# EAGLE design WiFiPicoDMX_RevA (EAGLE 9.6.2)
WiFiPicoDMX Rev. A preliminary Fusion/EAGLE schematic. Generated from docs/hardware/SCHEMATIC_DESIGN.md. Electrical review and manufacturer footprint verification are mandatory before PCB release.

## Sheet 1 of 3
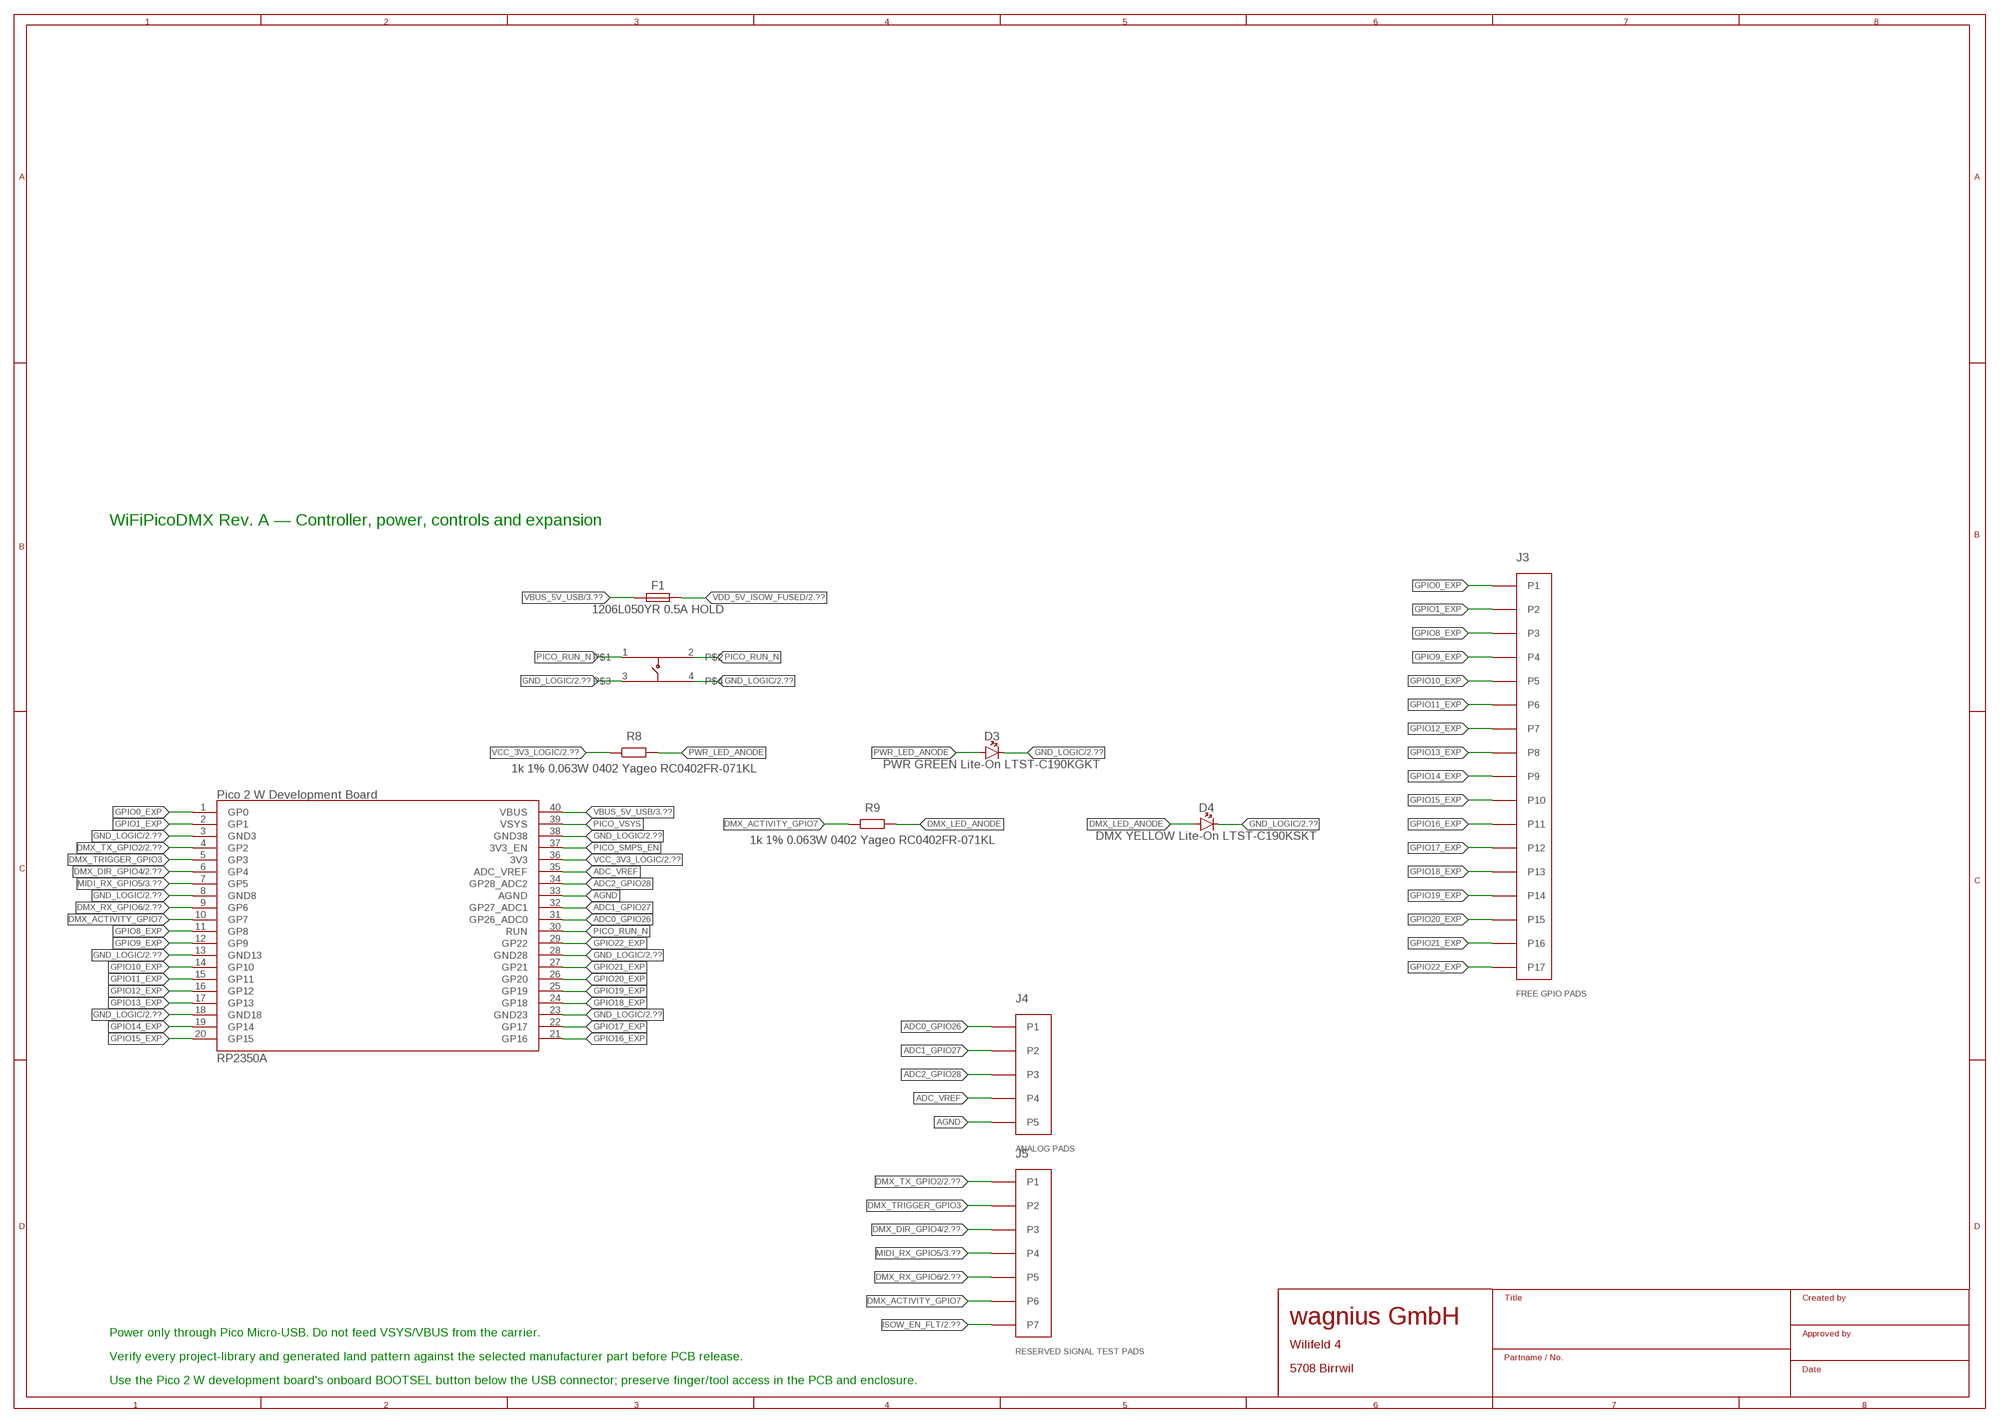
[diagram p0: schematic, sheet 1]

### Parts
D3  PWR GREEN Lite-On LTST-C190KGKT  LED0603  [LEDC1608X55N_FLAT-B]
D4  DMX YELLOW Lite-On LTST-C190KSKT  LED0603  [LEDC1608X55N_FLAT-B]
F1  1206L050YR 0.5A HOLD  PPTC1206  [PPTC1206_1206L050YR]
J3  FREE GPIO PADS  PADBANK17  [PADBANK17]
J4  ANALOG PADS  PADBANK5  [PADBANK5]
J5  RESERVED SIGNAL TEST PADS  PADBANK7  [PADBANK7]
R8  1k 1% 0.063W 0402 Yageo RC0402FR-071KL  RES0402  [RESC1005X40]
R9  1k 1% 0.063W 0402 Yageo RC0402FR-071KL  RES0402  [RESC1005X40]
SW1  PTS810SJM250SMTR LFS RESET (NO)  SWITCH_SMD  [PTS810_J_LEAD]
U1  Raspberry Pi Pico 2 W  PICO2W  [PICO_2_W_DEVELOPMENT_BOARD]

### Nets
ADC0_GPIO26: J4.1 U1.31(GP26_ADC0)
ADC1_GPIO27: J4.2 U1.32(GP27_ADC1)
ADC2_GPIO28: J4.3 U1.34(GP28_ADC2)
ADC_VREF: J4.4 U1.35(ADC_VREF)
AGND: J4.5 U1.33(AGND)
DMX_ACTIVITY_GPIO7: J5.6 R9.1 U1.10(GP7)
DMX_DIR_GPIO4: J5.3 U1.6(GP4) ; also sheet 2
DMX_LED_ANODE: D4.A R9.2
DMX_RX_GPIO6: J5.5 U1.9(GP6) ; also sheet 2
DMX_TRIGGER_GPIO3: J5.2 U1.5(GP3)
DMX_TX_GPIO2: J5.1 U1.4(GP2) ; also sheet 2
GND_LOGIC: D3.C(K) D4.C(K) SW1.3 SW1.4 U1.3(GND3) U1.8(GND8) U1.13(GND13) U1.18(GND18) U1.23(GND23) U1.28(GND28) U1.38(GND38) ; also sheet 2,3
GPIO0_EXP: J3.1 U1.1(GP0)
GPIO1_EXP: J3.2 U1.2(GP1)
GPIO8_EXP: J3.3 U1.11(GP8)
GPIO9_EXP: J3.4 U1.12(GP9)
GPIO10_EXP: J3.5 U1.14(GP10)
GPIO11_EXP: J3.6 U1.15(GP11)
GPIO12_EXP: J3.7 U1.16(GP12)
GPIO13_EXP: J3.8 U1.17(GP13)
GPIO14_EXP: J3.9 U1.19(GP14)
GPIO15_EXP: J3.10 U1.20(GP15)
GPIO16_EXP: J3.11 U1.21(GP16)
GPIO17_EXP: J3.12 U1.22(GP17)
GPIO18_EXP: J3.13 U1.24(GP18)
GPIO19_EXP: J3.14 U1.25(GP19)
GPIO20_EXP: J3.15 U1.26(GP20)
GPIO21_EXP: J3.16 U1.27(GP21)
GPIO22_EXP: J3.17 U1.29(GP22)
ISOW_EN_FLT: J5.7 ; also sheet 2
MIDI_RX_GPIO5: J5.4 U1.7(GP5) ; also sheet 3
PICO_RUN_N: SW1.1 SW1.2 U1.30(RUN)
PICO_SMPS_EN: U1.37(3V3_EN)
PICO_VSYS: U1.39(VSYS)
PWR_LED_ANODE: D3.A R8.2
VBUS_5V_USB: F1.1 U1.40(VBUS) ; also sheet 3
VCC_3V3_LOGIC: R8.1 U1.36(3V3) ; also sheet 2,3
VDD_5V_ISOW_FUSED: F1.2 ; also sheet 2

### Notes on the sheet
- WiFiPicoDMX Rev. A — Controller, power, controls and expansion
- Power only through Pico Micro-USB. Do not feed VSYS/VBUS from the carrier.
- Verify every project-library and generated land pattern against the selected manufacturer part before PCB release.
- Use the Pico 2 W development board's onboard BOOTSEL button below the USB connector; preserve finger/tool access in the PCB and enclosure.

## Sheet 2 of 3
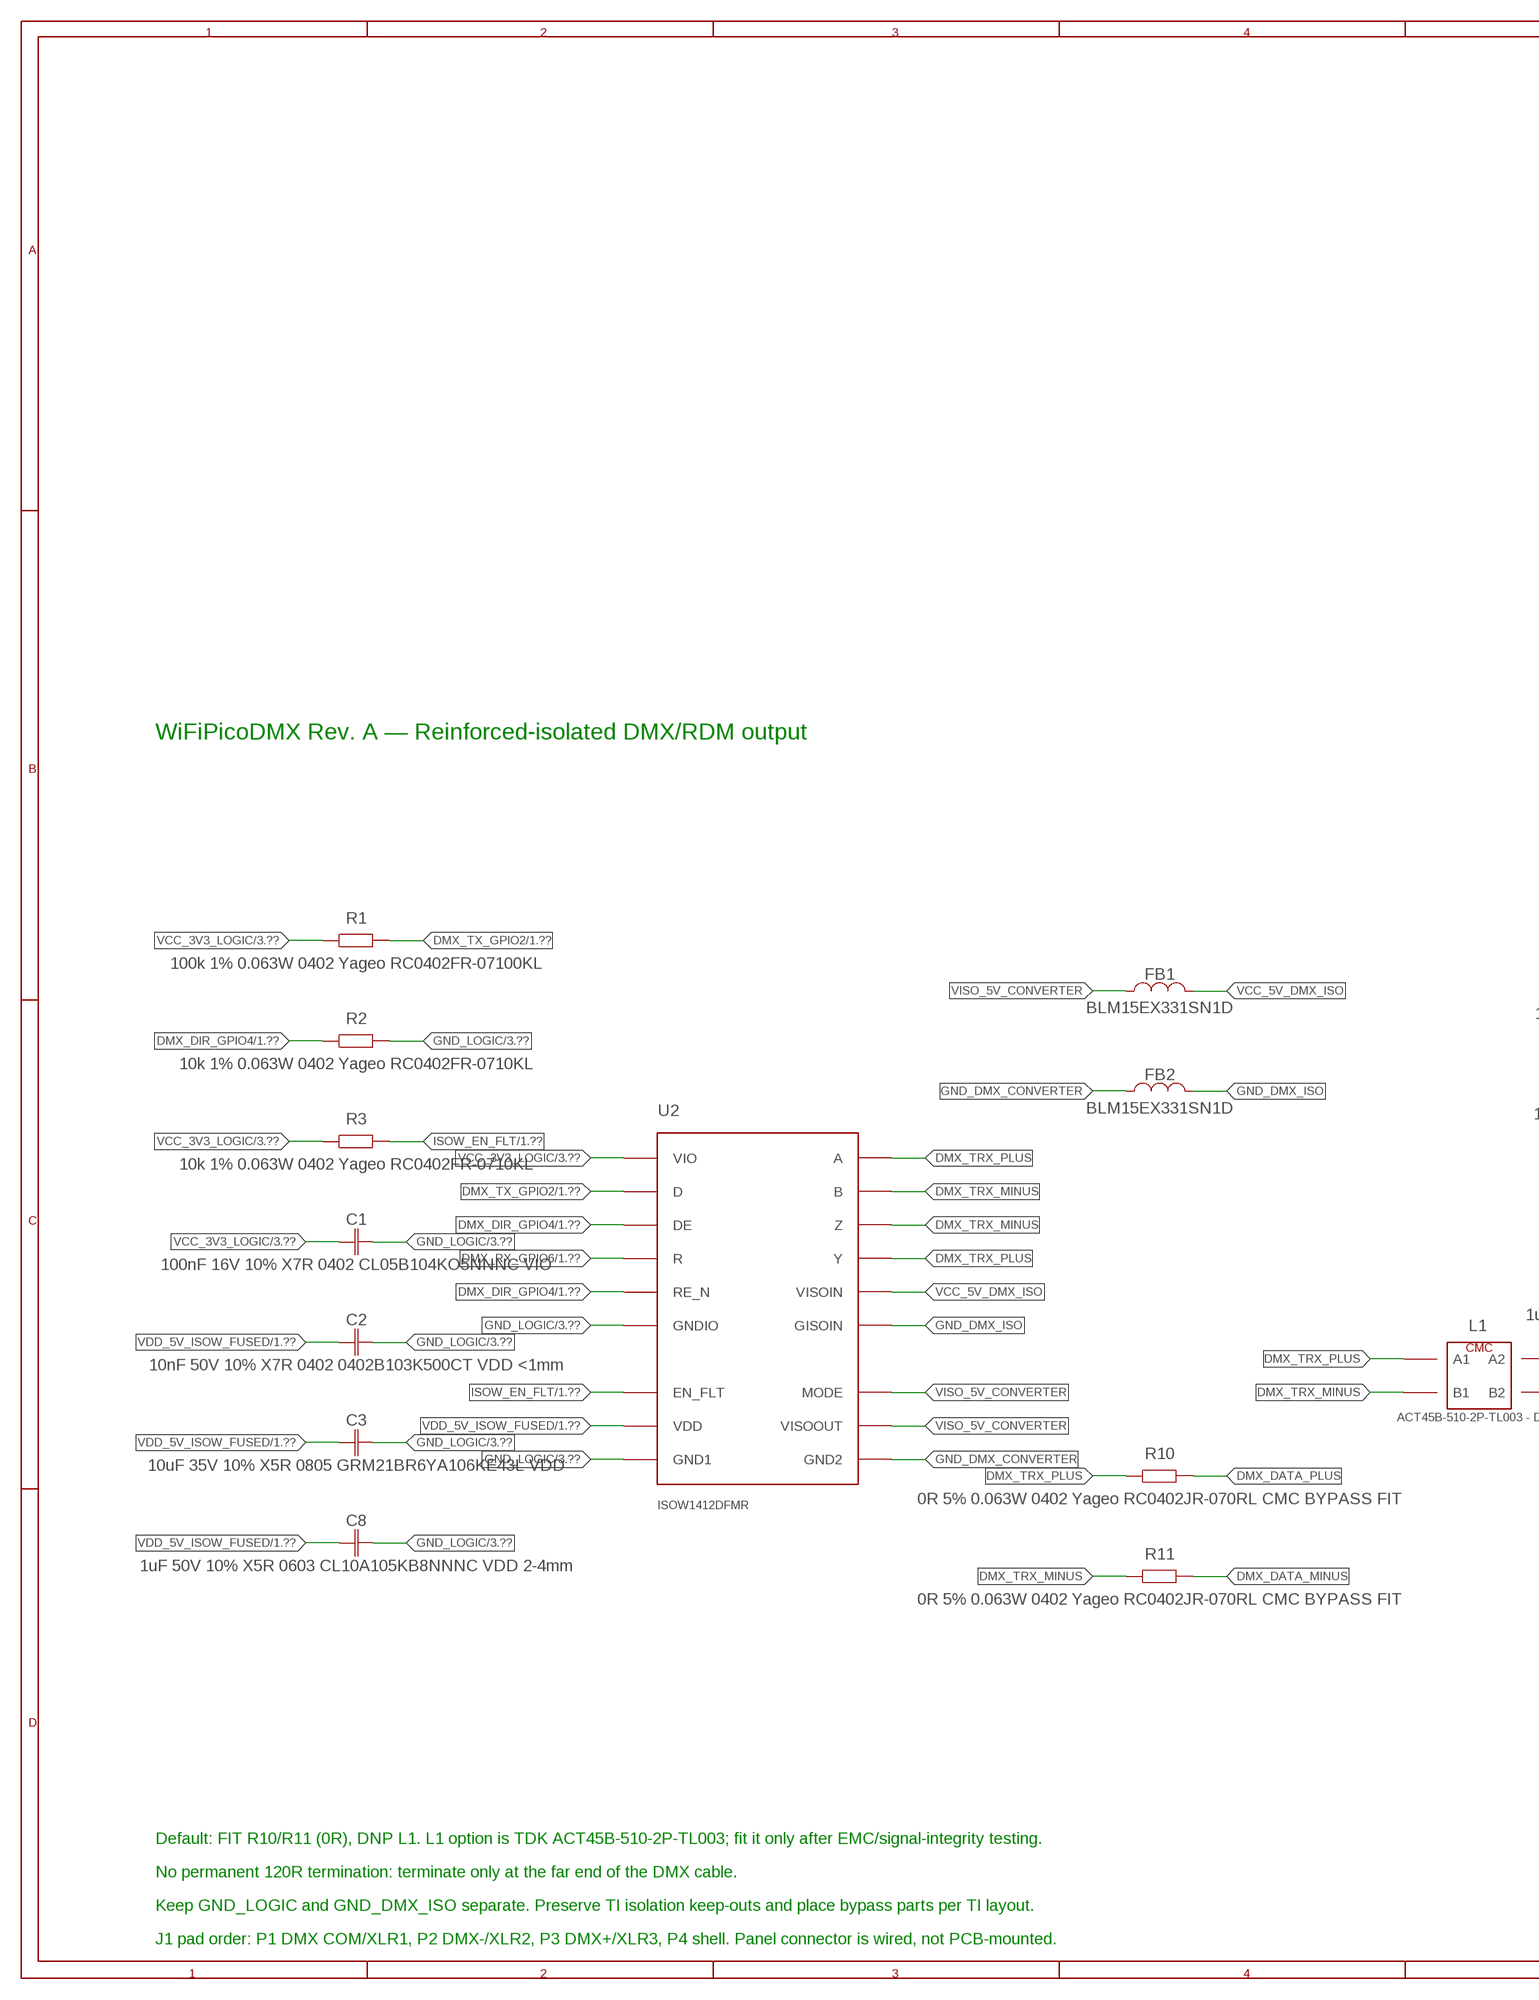
[diagram p1: schematic, sheet 2, part 1 of 2]
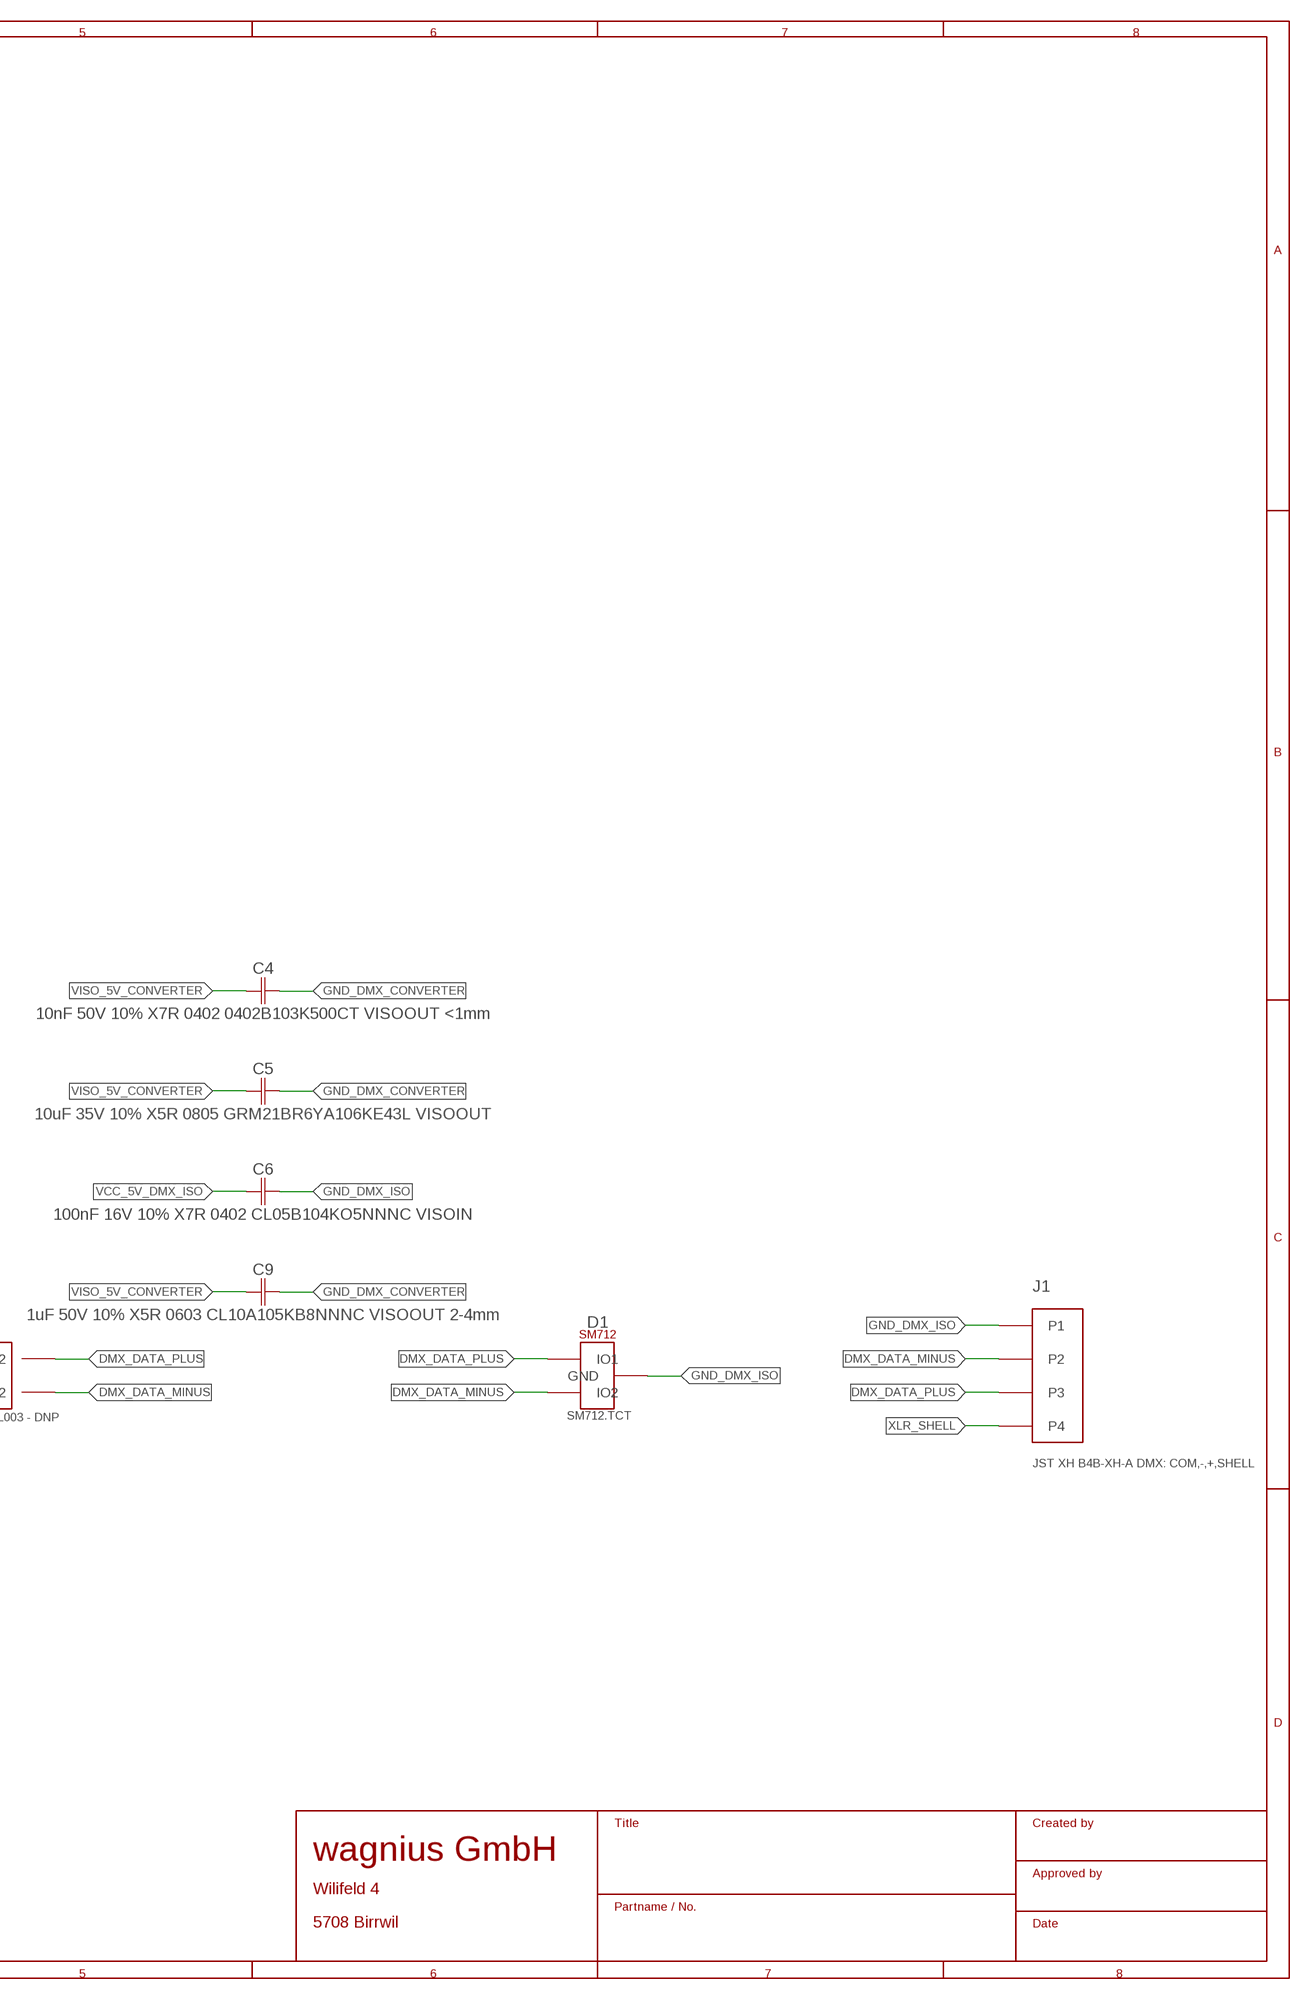
[diagram p2: schematic, sheet 2, part 2 of 2]

### Parts
C1  100nF 16V 10% X7R 0402 CL05B104KO5NNNC VIO  CAP0402  [CAPC1005X60]
C2  10nF 50V 10% X7R 0402 0402B103K500CT VDD <1mm  CAP0402  [CAPC1005X60]
C3  10uF 35V 10% X5R 0805 GRM21BR6YA106KE43L VDD  CAP0805  [CAPC2012X110]
C4  10nF 50V 10% X7R 0402 0402B103K500CT VISOOUT <1mm  CAP0402  [CAPC1005X60]
C5  10uF 35V 10% X5R 0805 GRM21BR6YA106KE43L VISOOUT  CAP0805  [CAPC2012X110]
C6  100nF 16V 10% X7R 0402 CL05B104KO5NNNC VISOIN  CAP0402  [CAPC1005X60]
C8  1uF 50V 10% X5R 0603 CL10A105KB8NNNC VDD 2-4mm  CAP0603  [CAPC1608X85]
C9  1uF 50V 10% X5R 0603 CL10A105KB8NNNC VISOOUT 2-4mm  CAP0603  [CAPC1608X85]
D1  SM712.TCT  SM712  [SOT23_]
FB1  BLM15EX331SN1D  FERRITE0402  [INDC1006X60N]
FB2  BLM15EX331SN1D  FERRITE0402  [INDC1006X60N]
J1  JST XH B4B-XH-A DMX: COM,-,+,SHELL  PANEL_DMX4  [B4B-XH-A]
L1  ACT45B-510-2P-TL003 - DNP  CMC_OPTION  [ACT45B_4P5X3P2]
R1  100k 1% 0.063W 0402 Yageo RC0402FR-07100KL  RES0402  [RESC1005X40]
R2  10k 1% 0.063W 0402 Yageo RC0402FR-0710KL  RES0402  [RESC1005X40]
R3  10k 1% 0.063W 0402 Yageo RC0402FR-0710KL  RES0402  [RESC1005X40]
R10  0R 5% 0.063W 0402 Yageo RC0402JR-070RL CMC BYPASS FIT  RES0402  [RESC1005X40]
R11  0R 5% 0.063W 0402 Yageo RC0402JR-070RL CMC BYPASS FIT  RES0402  [RESC1005X40]
U2  ISOW1412DFMR  [DFM0020A_TI]

### Nets
DMX_DATA_MINUS: D1.2(IO2) J1.2 L1.3(B2) R11.2
DMX_DATA_PLUS: D1.1(IO1) J1.3 L1.2(A2) R10.2
DMX_DIR_GPIO4: R2.1 U2.3(DE) U2.5(RE_N) ; also sheet 1
DMX_RX_GPIO6: U2.4(R) ; also sheet 1
DMX_TRX_MINUS: L1.4(B1) R11.1 U2.18(Z) U2.19(B)
DMX_TRX_PLUS: L1.1(A1) R10.1 U2.17(Y) U2.20(A)
DMX_TX_GPIO2: R1.2 U2.2(D) ; also sheet 1
GND_DMX_CONVERTER: C4.2 C5.2 C9.2 FB2.1 U2.11(GND2)
GND_DMX_ISO: C6.2 D1.3(GND) FB2.2 J1.1 U2.15(GISOIN)
GND_LOGIC: C1.2 C2.2 C3.2 C8.2 R2.2 U2.6(GNDIO) U2.10(GND1) ; also sheet 1,3
ISOW_EN_FLT: R3.2 U2.8(EN_FLT) ; also sheet 1
VCC_3V3_LOGIC: C1.1 R1.1 R3.1 U2.1(VIO) ; also sheet 1,3
VCC_5V_DMX_ISO: C6.1 FB1.2 U2.16(VISOIN)
VDD_5V_ISOW_FUSED: C2.1 C3.1 C8.1 U2.9(VDD) ; also sheet 1
VISO_5V_CONVERTER: C4.1 C5.1 C9.1 FB1.1 U2.12(VISOOUT) U2.13(MODE)
XLR_SHELL: J1.4

### Notes on the sheet
- WiFiPicoDMX Rev. A — Reinforced-isolated DMX/RDM output
- Default: FIT R10/R11 (0R), DNP L1. L1 option is TDK ACT45B-510-2P-TL003; fit it only after EMC/signal-integrity testing.
- No permanent 120R termination: terminate only at the far end of the DMX cable.
- Keep GND_LOGIC and GND_DMX_ISO separate. Preserve TI isolation keep-outs and place bypass parts per TI layout.
- J1 pad order: P1 DMX COM/XLR1, P2 DMX-/XLR2, P3 DMX+/XLR3, P4 shell. Panel connector is wired, not PCB-mounted.

## Sheet 3 of 3
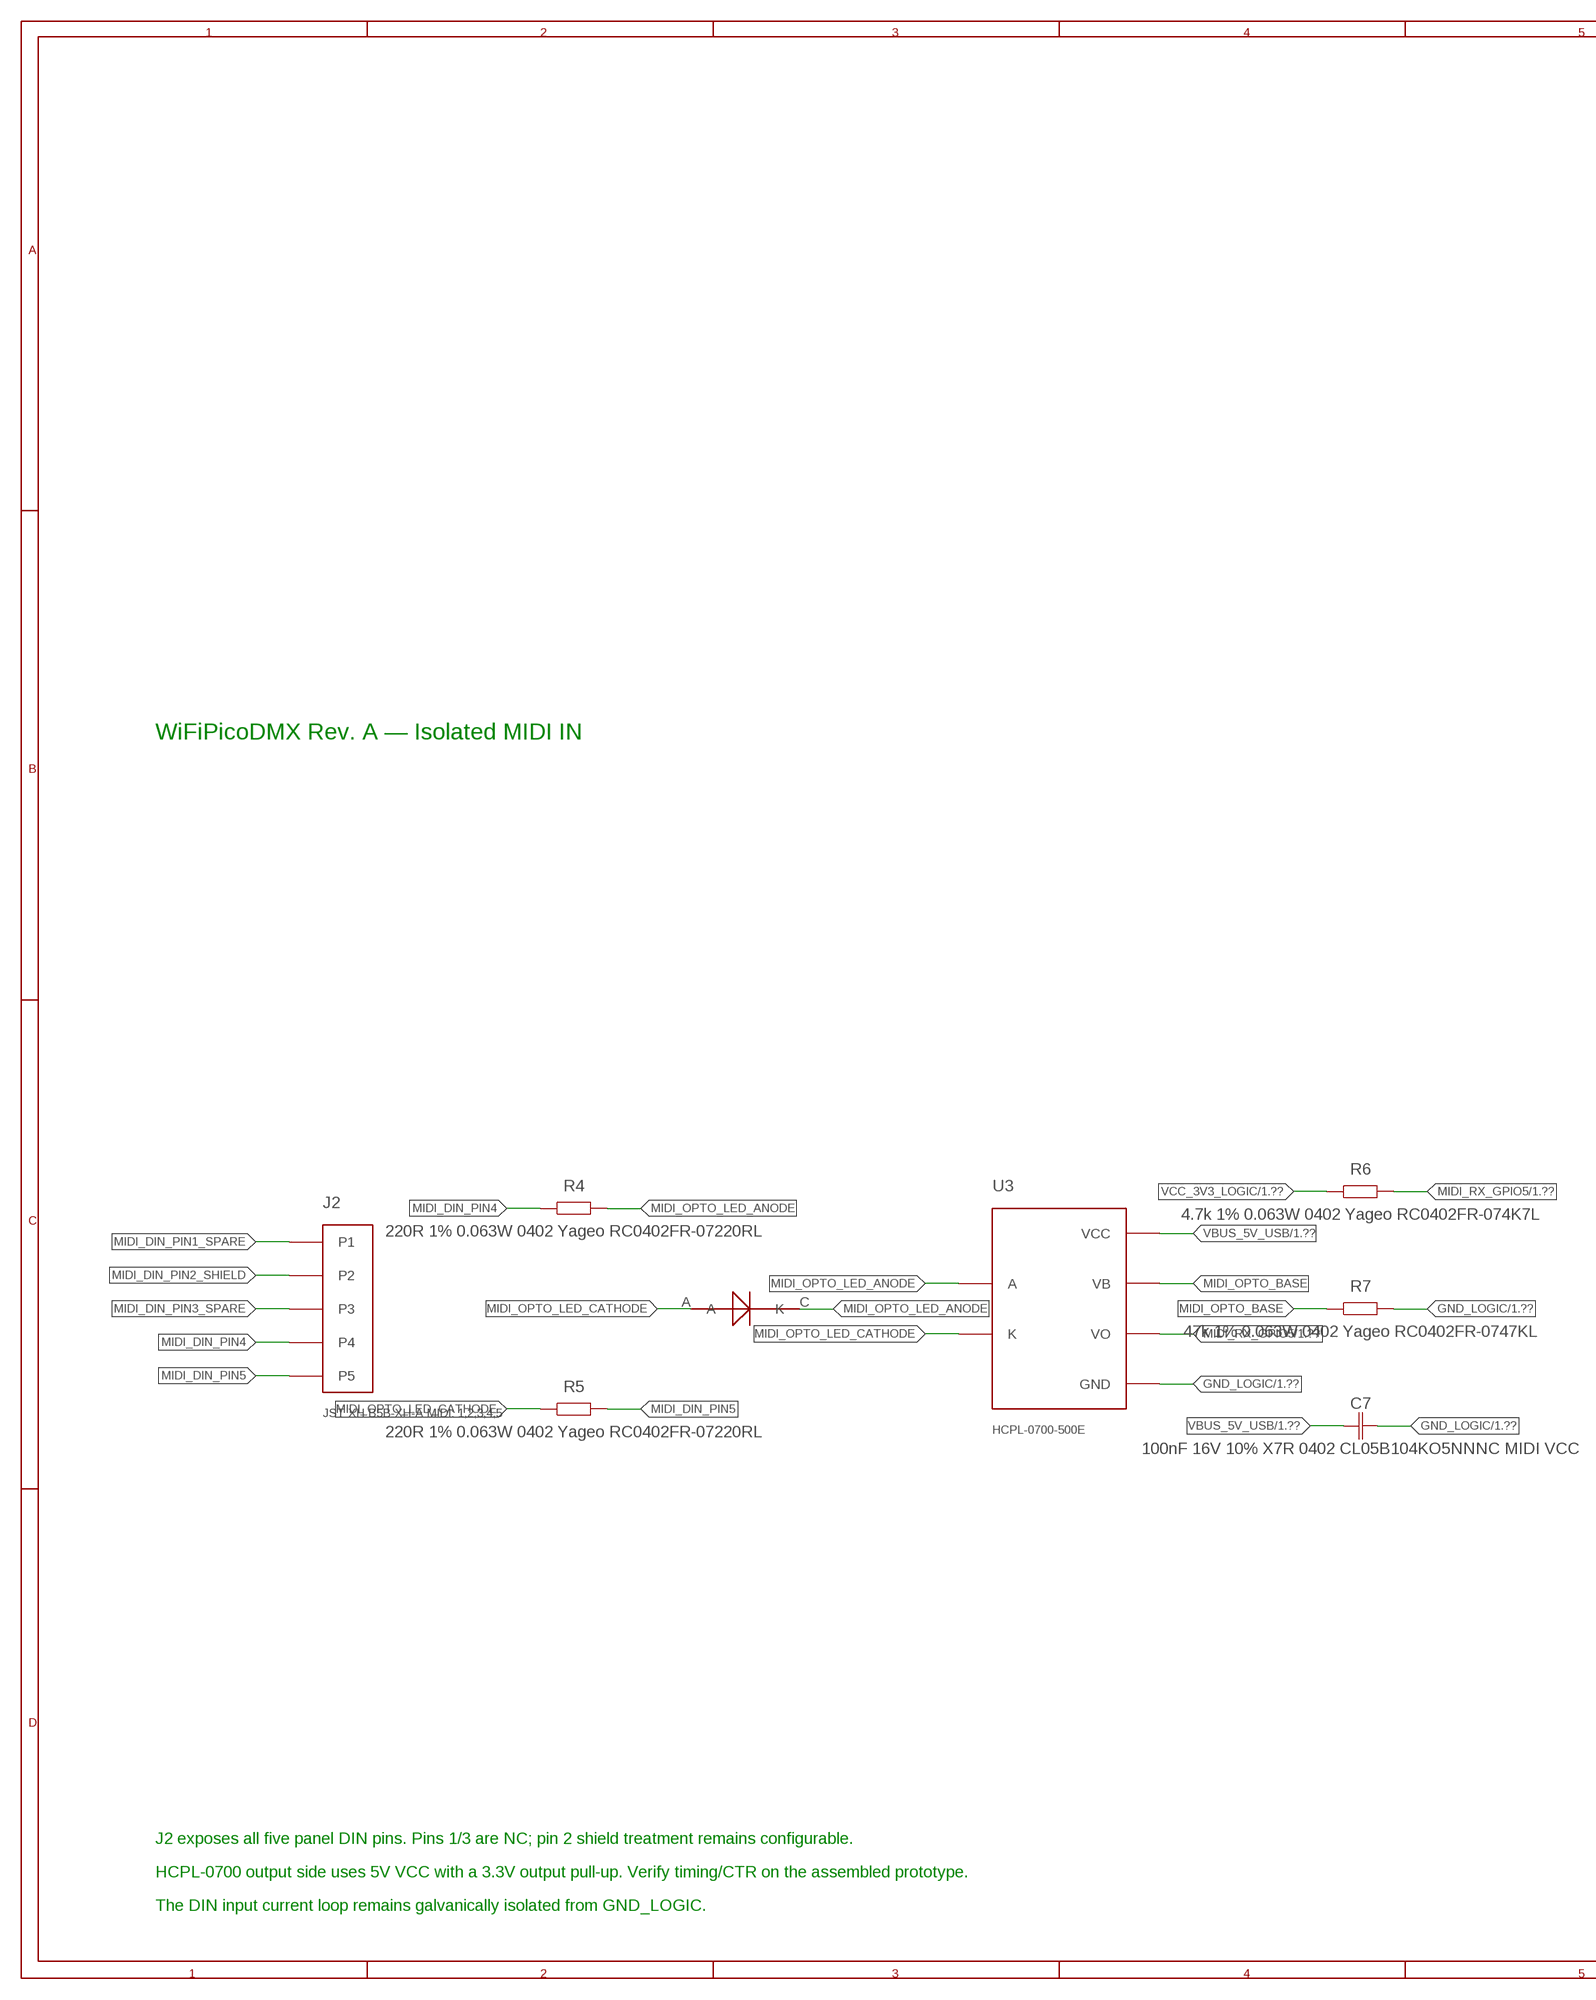
[diagram p3: schematic, sheet 3, part 1 of 2]
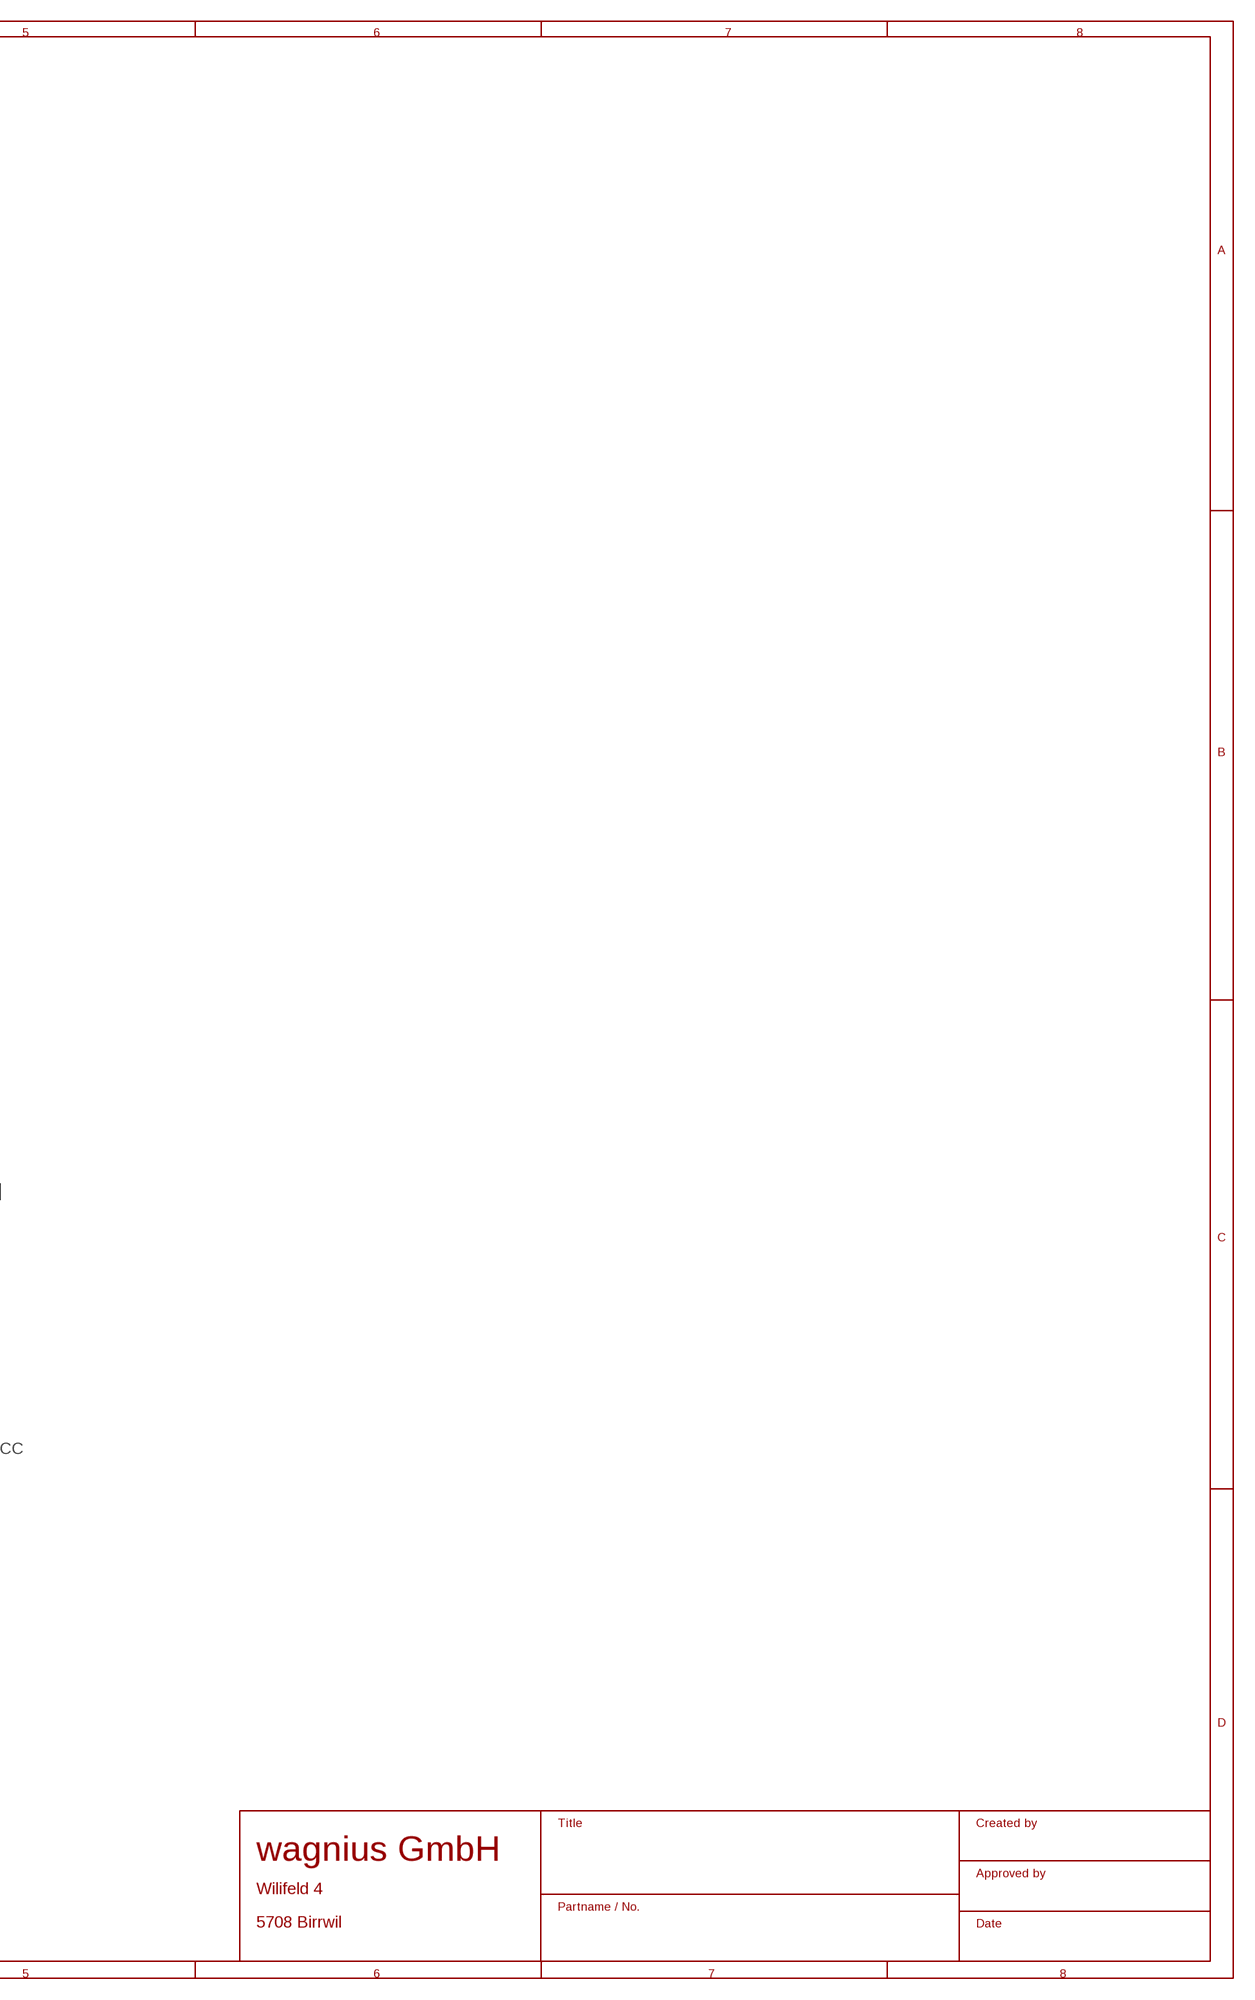
[diagram p4: schematic, sheet 3, part 2 of 2]

### Parts
C7  100nF 16V 10% X7R 0402 CL05B104KO5NNNC MIDI VCC  CAP0402  [CAPC1005X60]
D2  1N4148WS-E3-08  DIODE_SOD323  [SOD323_VISHAY]
J2  JST XH B5B-XH-A MIDI: 1,2,3,4,5  PANEL_MIDI5  [B5B-XH-A]
R4  220R 1% 0.063W 0402 Yageo RC0402FR-07220RL  RES0402  [RESC1005X40]
R5  220R 1% 0.063W 0402 Yageo RC0402FR-07220RL  RES0402  [RESC1005X40]
R6  4.7k 1% 0.063W 0402 Yageo RC0402FR-074K7L  RES0402  [RESC1005X40]
R7  47k 1% 0.063W 0402 Yageo RC0402FR-0747KL  RES0402  [RESC1005X40]
U3  HCPL-0700-500E  HCPL_0700_500E  [HCPL0700_SO8]

### Nets
GND_LOGIC: C7.2 R7.2 U3.5(GND) ; also sheet 1,2
MIDI_DIN_PIN1_SPARE: J2.1
MIDI_DIN_PIN2_SHIELD: J2.2
MIDI_DIN_PIN3_SPARE: J2.3
MIDI_DIN_PIN4: J2.4 R4.1
MIDI_DIN_PIN5: J2.5 R5.2
MIDI_OPTO_BASE: R7.1 U3.7(VB)
MIDI_OPTO_LED_ANODE: D2.C(K) R4.2 U3.2(A)
MIDI_OPTO_LED_CATHODE: D2.A R5.1 U3.3(K)
MIDI_RX_GPIO5: R6.2 U3.6(VO) ; also sheet 1
VBUS_5V_USB: C7.1 U3.8(VCC) ; also sheet 1
VCC_3V3_LOGIC: R6.1 ; also sheet 1,2

### Notes on the sheet
- WiFiPicoDMX Rev. A — Isolated MIDI IN
- J2 exposes all five panel DIN pins. Pins 1/3 are NC; pin 2 shield treatment remains configurable.
- HCPL-0700 output side uses 5V VCC with a 3.3V output pull-up. Verify timing/CTR on the assembled prototype.
- The DIN input current loop remains galvanically isolated from GND_LOGIC.

## Library data of the parts
C1 C2 C4 C6 C7 = WiFiPicoDMX_RevA_used:CAP0402: 0402 capacitor using project-library land pattern
C3 C5 = WiFiPicoDMX_RevA_used:CAP0805: 0805 capacitor using project-library land pattern
C8 C9 = WiFiPicoDMX_RevA_used:CAP0603: 0603 capacitor using project-library land pattern
D1 = WiFiPicoDMX_RevA_used:SM712: Semtech SM712.TCT RS-485 TVS using the user-supplied project-library SOT-23 package
D2 = WiFiPicoDMX_RevA_used:DIODE_SOD323: Vishay 1N4148WS-E3-08 using manufacturer-recommended project-library land pattern
D3 D4 = WiFiPicoDMX_RevA_used:LED0603: 0603 indicator LED using project-library land pattern
F1 = WiFiPicoDMX_RevA_used:PPTC1206: Littelfuse 1206L050YR using project-library land pattern
FB1 FB2 = WiFiPicoDMX_RevA_used:FERRITE0402: Murata BLM15EX331SN1D using project-library land pattern
J1 = WiFiPicoDMX_RevA_used:PANEL_DMX4: JST XH B4B-XH-A board header for the panel XLR harness
J2 = WiFiPicoDMX_RevA_used:PANEL_MIDI5: JST XH B5B-XH-A board header for the panel DIN-5 harness
J3 = WiFiPicoDMX_RevA_used:PADBANK17: Free GPIO SMD pad bank
J4 = WiFiPicoDMX_RevA_used:PADBANK5: Analog SMD pad bank
J5 = WiFiPicoDMX_RevA_used:PADBANK7: Diagnostic SMD pad bank
L1 = WiFiPicoDMX_RevA_used:CMC_OPTION: TDK ACT45B-510-2P-TL003 two-line common-mode choke using project-library land pattern; normally DNP pending EMC and signal-integrity testing
R1-R11 = WiFiPicoDMX_RevA_used:RES0402: 0402 resistor using project-library land pattern
SW1 = WiFiPicoDMX_RevA_used:SWITCH_SMD: C&K/Littelfuse PTS810SJM250SMTR LFS using project-library land pattern
U1 = WiFiPicoDMX_RevA_used:PICO2W: Raspberry Pi Pico 2 W development board using project-library through-hole header land pattern
U2 = WiFiPicoDMX_RevA_used:ISOW1412DFMR: TI reinforced isolated RS-485/RDM transceiver with integrated isolated DC/DC
U3 = WiFiPicoDMX_RevA_used:HCPL_0700_500E: Broadcom HCPL-0700-500E SOIC-8 optocoupler using project-library land pattern

## Net classes
0 default: width 0.25 mm, drill 0.3 mm, clearance 0.2 mm

## Board
WiFiPicoDMX Rev. A basic two-layer placement. Unrouted engineering starting point: run DRC, review isolation, and complete routing manually before manufacture.
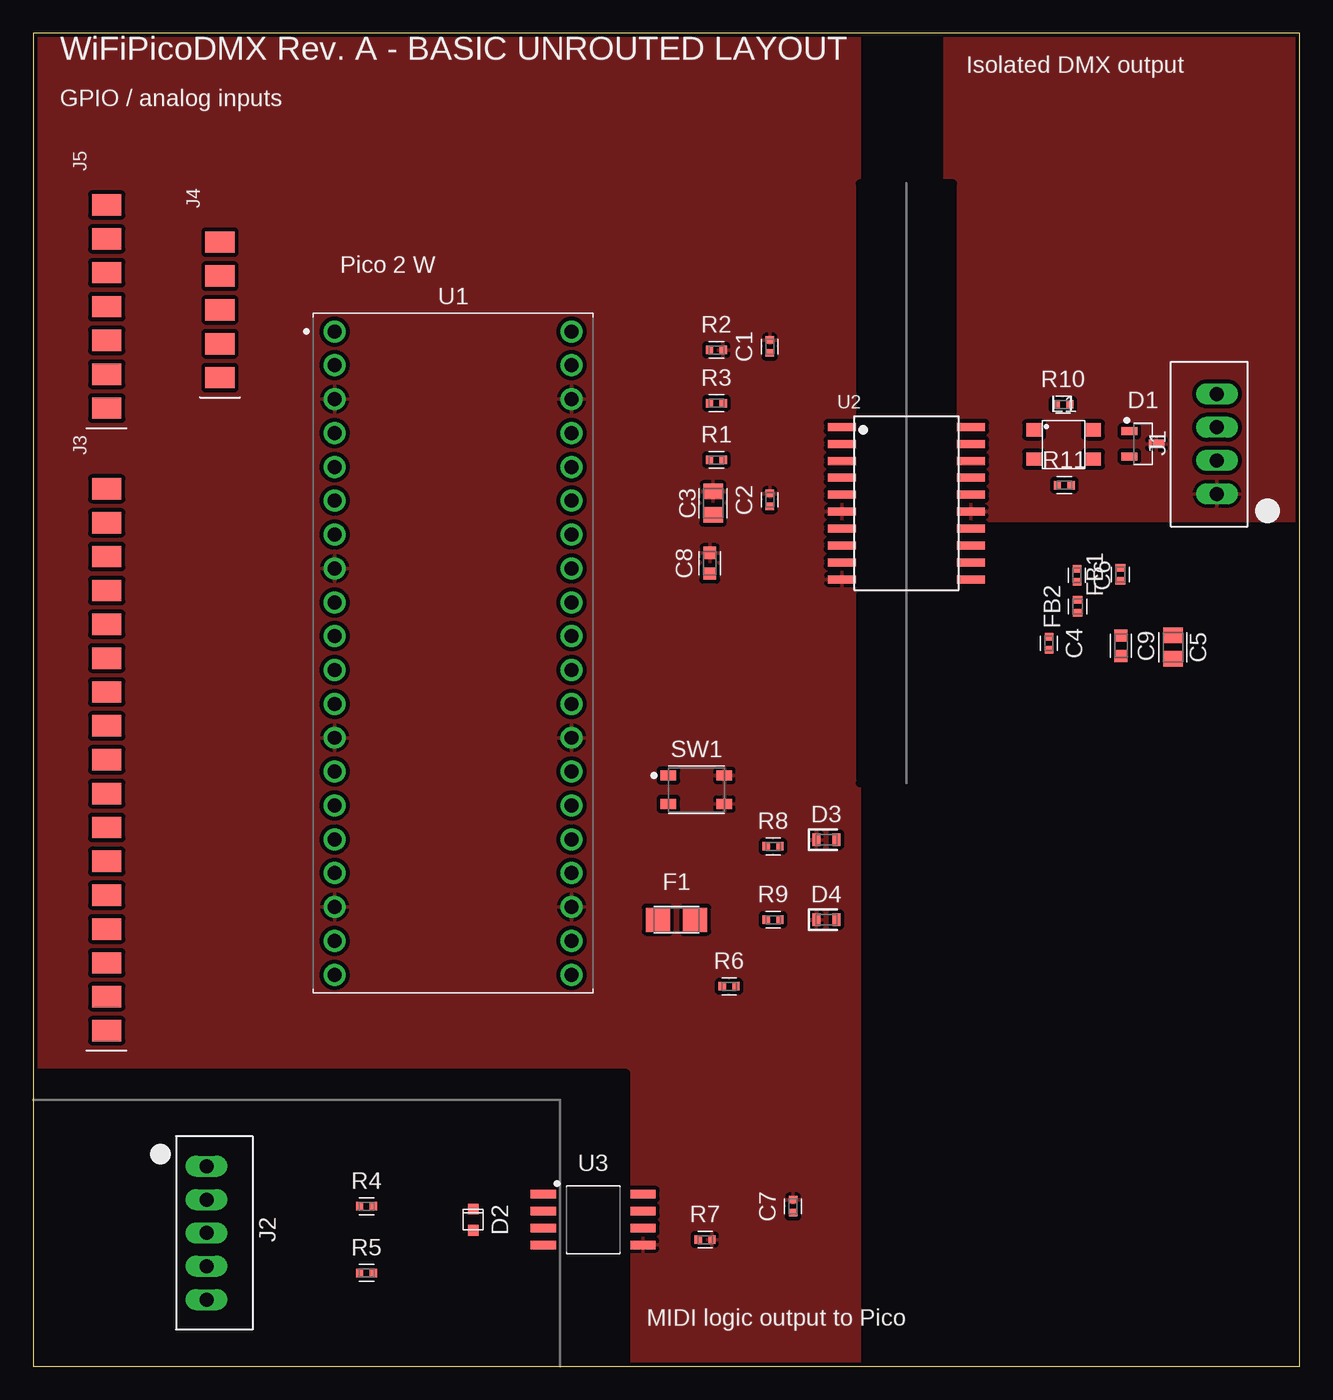
[diagram p5: board, top side]
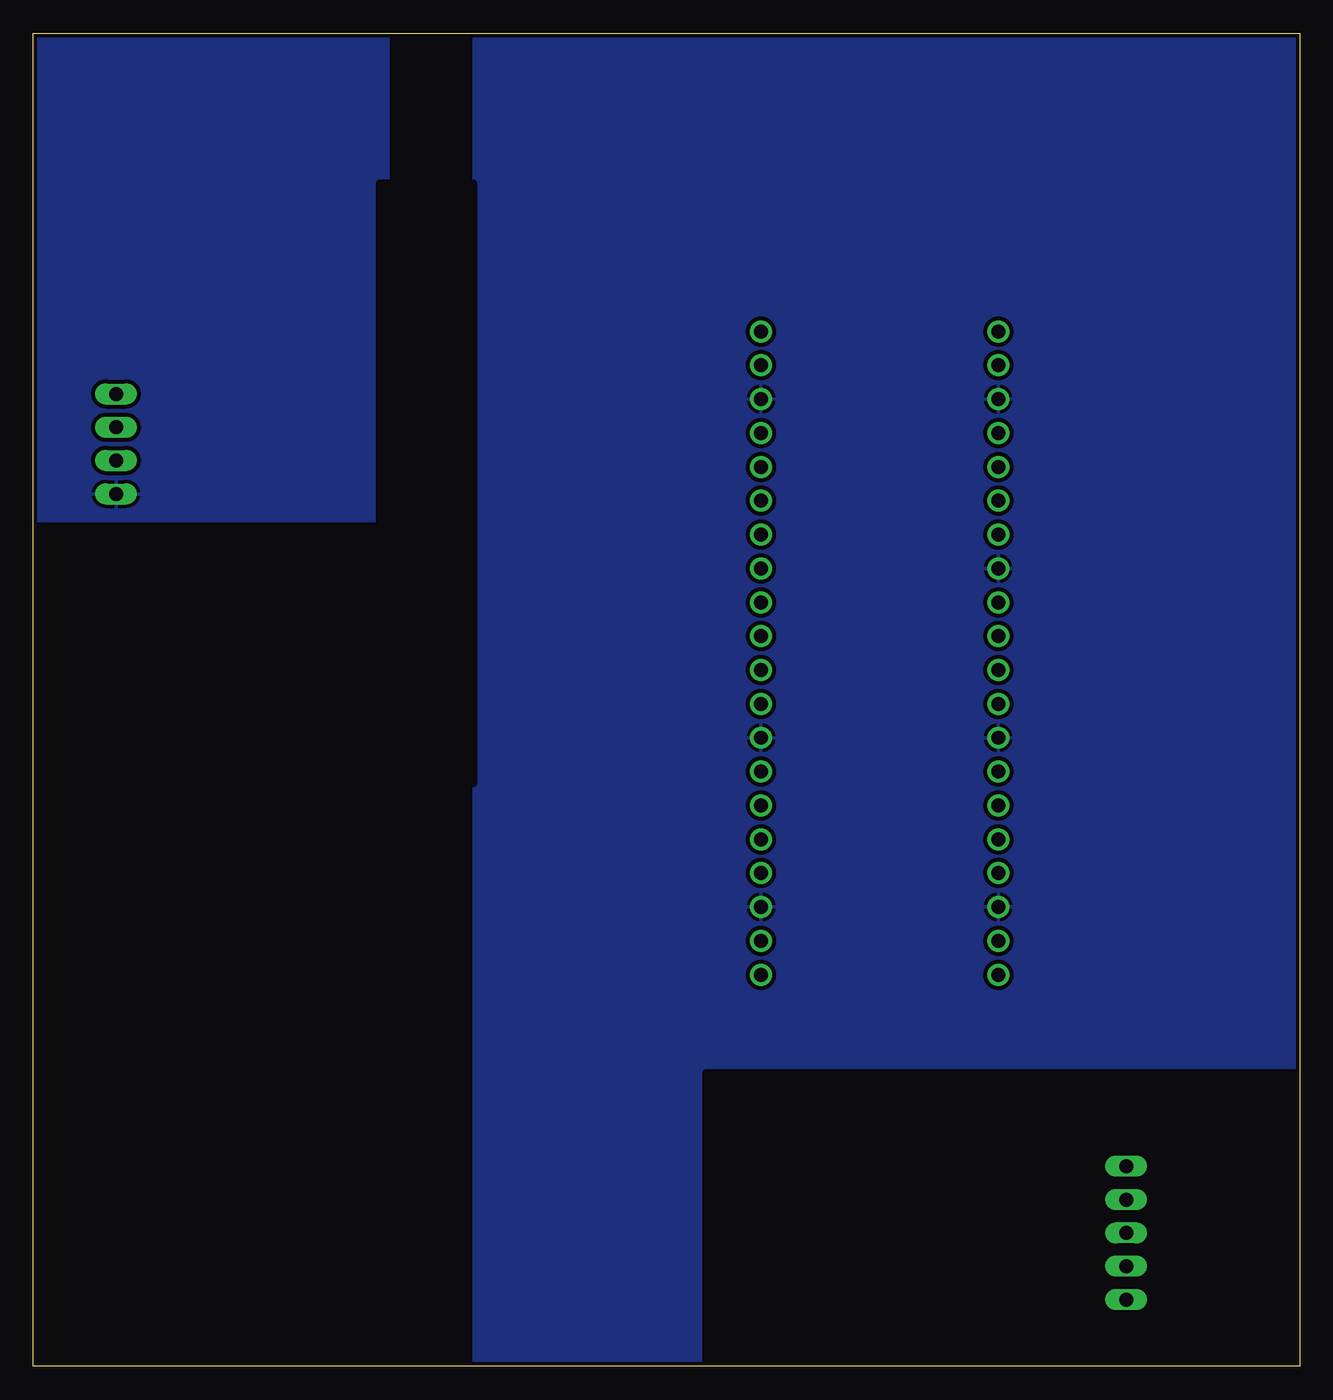
[diagram p6: board, bottom side, seen from below]

Size 95 x 100 mm. Coordinates in mm from the lower left corner, seen from the top.
Outline: 0,0 95,0 95,100 0,100 0,0
Copper layers (1*16): Top 0.035mm / dielectric 1.5mm / Bottom 0.035mm
Design rules "WiFiPicoDMX_2Layer": minimum track width 0.2mm, minimum drill 0.3mm, track to track 0.2mm, track to pad 0.2mm, pad to pad 0.2mm, via to via 0.2mm, copper to edge 0.3mm, drill to drill 0.25mm
tRestrict: area 0,20 to 39.5,22; area 39.5,0 to 44.5,22; area 62,43.8 to 69,88.8
bRestrict: area 0,20 to 39.5,22; area 39.5,0 to 44.5,22; area 62,43.8 to 69,88.8
vRestrict: area 0,20 to 39.5,22; area 39.5,0 to 44.5,22; area 62,43.8 to 69,88.8

### Footprints (pad centres in the part's own frame; a part is rotated, then mirrored left to right if it is on the bottom)
CAPC1005X60 = smd 0.56 x 0.629: 1 -0.485,0; 2 0.485,0
CAPC2012X110 = smd 1.165 x 1.465: 1 -0.875,0; 2 0.875,0
CAPC1608X85 = smd 0.921 x 0.97: 1 -0.775,0; 2 0.775,0
SOT23_ = smd 1.182 x 0.612: 1 -1.025,0.95; 2 -1.025,-0.95; 3 1.025,0
SOD323_VISHAY = smd 0.8 x 0.8: A 0.8,0; C -0.8,0
LEDC1608X55N_FLAT-B = smd 0.612 x 0.912: A 0.75,0; C -0.75,0
PPTC1206_1206L050YR = smd 1.8 x 1.8: 1 -1.4,0; 2 1.4,0
INDC1006X60N = smd 0.56 x 0.729: 1 -0.485,0; 2 0.485,0
B4B-XH-A = drill 1.05 long: 1 0,0; 2 2.5,0; 3 5,0; 4 7.5,0
B5B-XH-A = drill 1.05 long: 1 -5,0; 2 -2.5,0; 3 0,0; 4 2.5,0; 5 5,0
PADBANK17 = smd 2.2 x 1.6: 1 0,-20.32; 2 0,-17.78; 3 0,-15.24; 4 0,-12.7; 5 0,-10.16; 6 0,-7.62; 7 0,-5.08; 8 0,-2.54; 9 0,0; 10 0,2.54; 11 0,5.08; 12 0,7.62; 13 0,10.16; 14 0,12.7; 15 0,15.24; 16 0,17.78; 17 0,20.32
PADBANK5 = smd 2.2 x 1.6: 1 0,-5.08; 2 0,-2.54; 3 0,0; 4 0,2.54; 5 0,5.08
PADBANK7 = smd 2.2 x 1.6: 1 0,-7.62; 2 0,-5.08; 3 0,-2.54; 4 0,0; 5 0,2.54; 6 0,5.08; 7 0,7.62
ACT45B_4P5X3P2 = smd 1.2 x 1: 1 -2.2,1.1; 2 2.2,1.1; 3 2.2,-1.1; 4 -2.2,-1.1
RESC1005X40 = smd 0.535 x 0.644: 1 -0.507,0; 2 0.507,0
PTS810_J_LEAD = smd 1.163 x 0.767: 1 -2.095,1.075; 2 -2.095,-1.075; 3 2.095,-1.075; 4 2.095,1.075
PICO_2_W_DEVELOPMENT_BOARD = drill 1.048 pad 1.649: 1 -8.89,24.13; 2 -8.89,21.59; 3 -8.89,19.05; 4 -8.89,16.51; 5 -8.89,13.97; 6 -8.89,11.43; 7 -8.89,8.89; 8 -8.89,6.35; 9 -8.89,3.81; 10 -8.89,1.27; 11 -8.89,-1.27; 12 -8.89,-3.81; 13 -8.89,-6.35; 14 -8.89,-8.89; 15 -8.89,-11.43; 16 -8.89,-13.97; 17 -8.89,-16.51; 18 -8.89,-19.05; 19 -8.89,-21.59; 20 -8.89,-24.13; 21 8.89,-24.13; 22 8.89,-21.59; 23 8.89,-19.05; 24 8.89,-16.51; 25 8.89,-13.97; 26 8.89,-11.43; 27 8.89,-8.89; 28 8.89,-6.35; 29 8.89,-3.81; 30 8.89,-1.27; 31 8.89,1.27; 32 8.89,3.81; 33 8.89,6.35; 34 8.89,8.89; 35 8.89,11.43; 36 8.89,13.97; 37 8.89,16.51; 38 8.89,19.05; 39 8.89,21.59; 40 8.89,24.13
DFM0020A_TI = smd 2.1 x 0.6: 1 -4.85,5.715; 2 -4.85,4.445; 3 -4.85,3.175; 4 -4.85,1.905; 5 -4.85,0.635; 6 -4.85,-0.635; 7 -4.85,-1.905; 8 -4.85,-3.175; 9 -4.85,-4.445; 10 -4.85,-5.715; 11 4.85,-5.715; 12 4.85,-4.445; 13 4.85,-3.175; 14 4.85,-1.905; 15 4.85,-0.635; 16 4.85,0.635; 17 4.85,1.905; 18 4.85,3.175; 19 4.85,4.445; 20 4.85,5.715
HCPL0700_SO8 = smd 1.9 x 0.64: 1 -3.745,1.905; 2 -3.745,0.635; 3 -3.745,-0.635; 4 -3.745,-1.905; 5 3.745,-1.905; 6 3.745,-0.635; 7 3.745,0.635; 8 3.745,1.905

### Placement (x,y rotation side)
C1  55.25,76.5 90 top
C2  55.25,65 90 top
C3  51,64.75 90 top
C4  76.2,54.25 270 top
C5  85.5,53.95 270 top
C6  78.3,59.35 270 top
C7  57,12 90 top
C8  50.75,60.25 90 top
C9  81.6,54.05 270 top
D1  83.25,69.2 0 top
D2  33,11 270 top
D3  59.5,39.5 0 top
D4  59.5,33.5 0 top
F1  48.25,33.5 0 top
FB1  81.55,59.4 90 top
FB2  78.35,57 90 top
J1  88.8,65.45 90 top
J2  13,10 270 top
J3  5.5,45.5 0 top
J4  14,79.25 0 top
J5  5.5,79.5 0 top
L1  77.3,69.15 0 top
R1  51.25,68 0 top
R2  51.25,76.25 0 top
R3  51.25,72.25 0 top
R4  25,12 0 top
R5  25,7 0 top
R6  52.2,28.5 0 top
R7  50.4,9.5 0 top
R8  55.5,39 0 top
R9  55.5,33.5 0 top
R10  77.25,72.15 0 top
R11  77.35,66.1 0 top
SW1  49.75,43.25 0 top
U1  31.5,53.5 0 top
U2  65.5,64.75 0 top
U3  42,11 0 top

### Tracks (layer width: path | path; a pad name or v marks a point on that pad's centre or on a via)
GND_DMX_ISO
  pour Top (isolate 0.3): 68.3,103 68.3,63.4 111,63.4 111,103
  pour Bottom (isolate 0.3): 68.3,101.5 107.6,101.5 107.6,63.4 68.3,63.4
GND_LOGIC
  pour Top (isolate 0.3): -2,103 62,103 62,-2 44.5,-2 44.5,22 -2,22
  pour Bottom (isolate 0.3): -1,99.6 62,99.6 62,-1.6 44.6,-1.6 44.6,22 -1,22

### Text on the board
tPlace: WiFiPicoDMX Rev. A - BASIC UNROUTED LAYOUT | Isolated DMX output | GPIO / analog inputs | Pico 2 W | MIDI logic output to Pico
tDocu: DMX ISOLATION - NO COPPER OR VIAS | MIDI ISOLATED INPUT - NO LOGIC COPPER